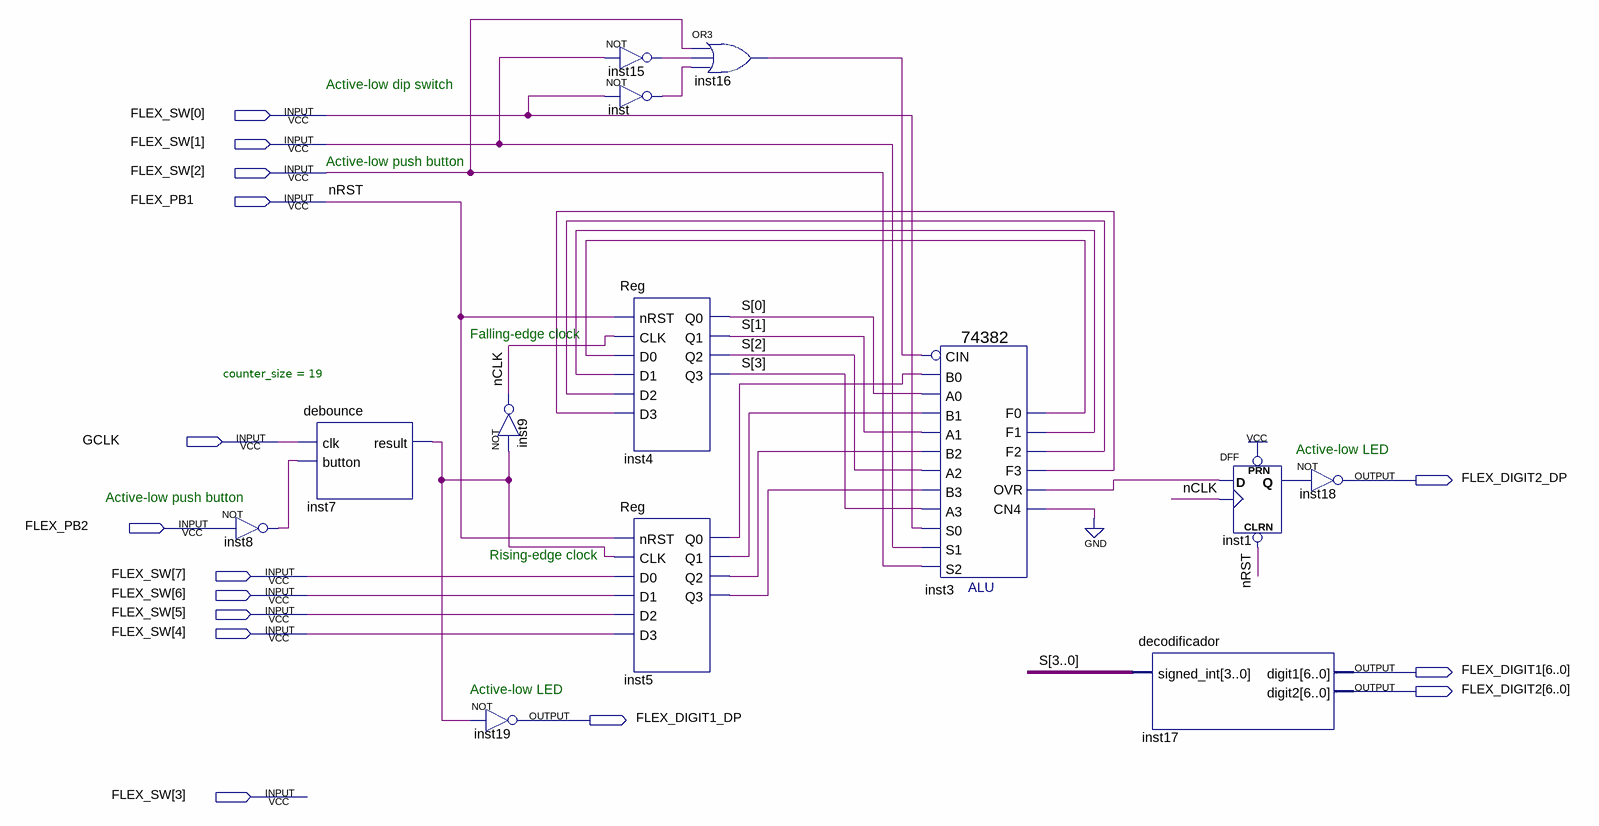
[diagram p0: schematic sheet]
// Quartus schematic Acumulador.bdf as structural Verilog: 13 symbols, 15 pins
module Acumulador (
  input  [7:0] FLEX_SW,
  input  FLEX_PB1,
  input  GCLK,
  input  FLEX_PB2,
  output FLEX_DIGIT2_DP,
  output [6:0] FLEX_DIGIT1,
  output [6:0] FLEX_DIGIT2,
  output FLEX_DIGIT1_DP
);

  wire inst1_q, inst3_cn4, inst3_f0, inst3_f1, inst3_f2, inst3_f3, inst3_ovr, inst5_q0, inst5_q1, inst5_q2,
       inst5_q3, inst7_result, inst8_out, inst15_out, inst16_out, inst_out, nCLK;
  wire [3:0] S;

  not inst8 (inst8_out, FLEX_PB2);
  debounce #(.counter_size(19)) inst7 (.clk(GCLK), .button(inst8_out), .result(inst7_result));
  not inst19 (FLEX_DIGIT1_DP, inst7_result);
  not inst9 (nCLK, inst7_result);
  not inst15 (inst15_out, FLEX_SW[1]);
  not inst (inst_out, FLEX_SW[0]);
  Reg inst4 (
    .nRST(FLEX_PB1), .CLK(nCLK), .D0(inst3_f0), .D1(inst3_f1), .D2(inst3_f2), .D3(inst3_f3), .Q0(S[0]),
    .Q1(S[1]), .Q2(S[2]), .Q3(S[3]));
  Reg inst5 (
    .nRST(FLEX_PB1), .CLK(inst7_result), .D0(FLEX_SW[7]), .D1(FLEX_SW[6]), .D2(FLEX_SW[5]), .D3(FLEX_SW[4]),
    .Q0(inst5_q0), .Q1(inst5_q1), .Q2(inst5_q2), .Q3(inst5_q3));
  or inst16 (inst16_out, FLEX_SW[2], inst15_out, inst_out);
  \74382  inst3 (
    .B3(inst5_q3), .A3(S[3]), .B0(inst5_q0), .A0(S[0]), .B1(inst5_q1), .S2(FLEX_SW[2]), .S1(FLEX_SW[1]),
    .S0(FLEX_SW[0]), .A1(S[1]), .B2(inst5_q2), .A2(S[2]), .CIN(inst16_out), .F1(inst3_f1), .F0(inst3_f0),
    .CN4(inst3_cn4), .F3(inst3_f3), .F2(inst3_f2), .OVR(inst3_ovr));
  decodificador inst17 (.signed_int(S), .digit1(FLEX_DIGIT1), .digit2(FLEX_DIGIT2));
  DFF inst1 (.CLRN(FLEX_PB1), .CLK(nCLK), .D(inst3_ovr), .PRN(1'b1), .Q(inst1_q));
  not inst18 (FLEX_DIGIT2_DP, inst1_q);
  // also tied to GND on the sheet: inst3_cn4

  // Other names for the same wires on the sheet: nRST = FLEX_PB1

  // Notes on the sheet:
  //   Active-low dip switch
  //   Active-low push button
  //   Falling-edge clock
  //   Active-low LED
  //   Active-low push button
  //   Rising-edge clock
  //   Active-low LED
endmodule
